# Altium schematic sheet BMS_Temp.SchDoc
size A4; Organization: Altium Limited; Address1: L3, 12a Rodborough Rd; Address2: Frenchs Forest; Address3: NSW; Address4: Australia 2086; SheetNumber: 6
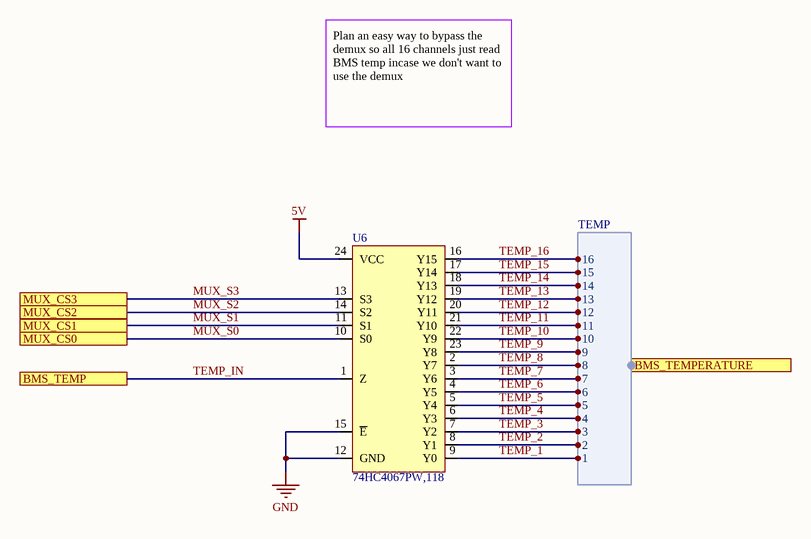
[diagram p0: BMS_Temp.SchDoc]

## Parts
U6  74HC4067PW,118  [24-TSSOP]

## Ports
BMS_TEMP, BMS_TEMPERATURE (harness TEMP), MUX_CS0, MUX_CS1, MUX_CS2, MUX_CS3

## Harnesses
TEMP: 1, 2, 3, 4, 5, 6, 7, 8, 9, 10, 11, 12, 13, 14, 15, 16

## Nets
5V: U6.24(VCC)
GND: U6.12(GND) U6.15(~{E})
MUX_S0: U6.10(S0) ; port MUX_CS0
MUX_S1: U6.11(S1) ; port MUX_CS1
MUX_S2: U6.14(S2) ; port MUX_CS2
MUX_S3: U6.13(S3) ; port MUX_CS3
TEMP_1: U6.9(Y0) ; port BMS_TEMPERATURE.1
TEMP_2: U6.8(Y1) ; port BMS_TEMPERATURE.2
TEMP_3: U6.7(Y2) ; port BMS_TEMPERATURE.3
TEMP_4: U6.6(Y3) ; port BMS_TEMPERATURE.4
TEMP_5: U6.5(Y4) ; port BMS_TEMPERATURE.5
TEMP_6: U6.4(Y5) ; port BMS_TEMPERATURE.6
TEMP_7: U6.3(Y6) ; port BMS_TEMPERATURE.7
TEMP_8: U6.2(Y7) ; port BMS_TEMPERATURE.8
TEMP_9: U6.23(Y8) ; port BMS_TEMPERATURE.9
TEMP_10: U6.22(Y9) ; port BMS_TEMPERATURE.10
TEMP_11: U6.21(Y10) ; port BMS_TEMPERATURE.11
TEMP_12: U6.20(Y11) ; port BMS_TEMPERATURE.12
TEMP_13: U6.19(Y12) ; port BMS_TEMPERATURE.13
TEMP_14: U6.18(Y13) ; port BMS_TEMPERATURE.14
TEMP_15: U6.17(Y14) ; port BMS_TEMPERATURE.15
TEMP_16: U6.16(Y15) ; port BMS_TEMPERATURE.16
TEMP_IN: U6.1(Z) ; port BMS_TEMP

## Notes on the sheet
- Plan an easy way to bypass the demux so all 16 channels just read BMS temp incase we don't want to use the demux
- Title
- Size:
- Date:
- B
- Number:
- Time:
- Revision:
- Sheet
- of
- File:

## Library data of the parts
U6 = MUX-74HC4067: IC MUX/DEMUX 1X16 24TSSOP; Manufacturer: Nexperia USA; Supplier 1: Digi-Key; Manufacturer Part Number: 74HC4067PW,118; Stock 1: 7949; Pricing 1: 1=0.87, 10=0.779, 25=0.7392, 100=0.6072, 250=0.5676, 500=0.5016, 1000=0.396 (USD); ComponentLink1URL: https://assets.nexperia.com/documents/data-sheet/74HC_HCT4067.pdf?src-supplier=Digi-Key; ComponentLink1Description: https://assets.nexperia.com/documents/data-sheet/74HC_HCT4067.pdf?src-supplier=Digi-Key; Supplier Part Number 1: 1727-2042-6-ND